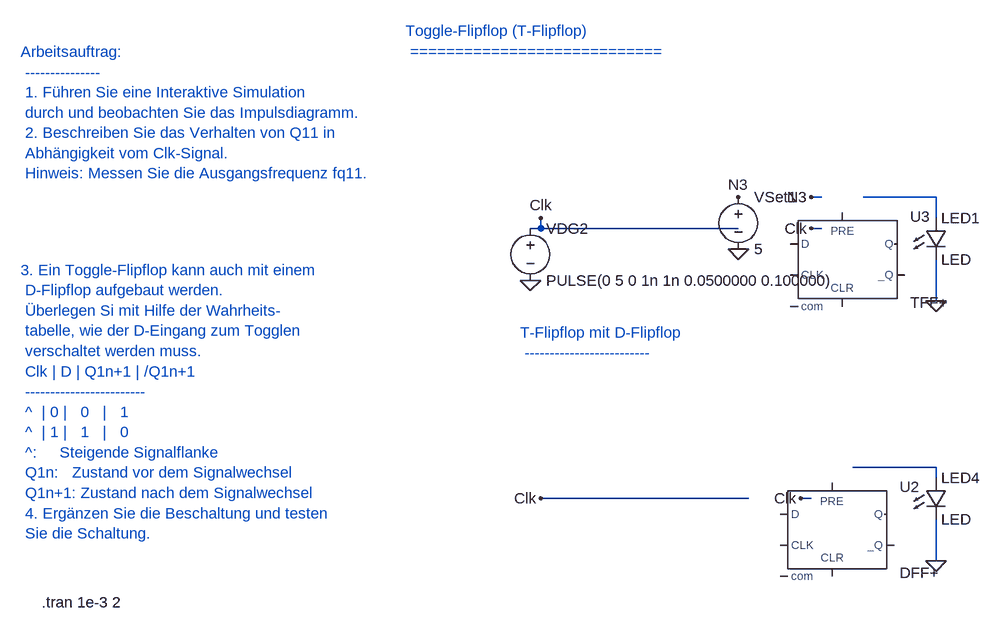
[diagram p0: schematic 6_1_5_Toggle_Flipflop.asc]
6_1_5_Toggle_Flipflop.asc, the LTspice schematic file:
Version 4
SHEET 1 880 680
WIRE 1440 400 1440 432
WIRE 1440 800 1440 832
WIRE 1440 464 1440 432
WIRE 816 352 832 352
WIRE 832 336 832 352
WIRE 832 768 1152 768
WIRE 1440 864 1440 832
WIRE 1312 720 1440 720
WIRE 1440 720 1440 736
WIRE 1328 304 1440 304
WIRE 1440 304 1440 336
WIRE 832 352 1136 352
WIRE 1248 768 1232 768
WIRE 1264 352 1248 352
WIRE 1264 304 1248 304
FLAG 1136 384 0
FLAG 816 432 0
FLAG 1440 464 0
FLAG 1440 864 0
FLAG 1440 464 0
FLAG 1440 864 0
FLAG 832 336 Clk
FLAG 832 768 Clk
FLAG 1232 768 Clk
FLAG 1248 352 Clk
FLAG 1136 304 N3
FLAG 1248 304 N3
SYMBOL voltage 1136 288 R0
SYMATTR InstName VSet1
SYMATTR Value 5
SYMBOL LED 1424 336 R0
SYMATTR InstName LED1
SYMATTR Value LED
SYMBOL voltage 816 336 R0
SYMATTR InstName VDG2
SYMATTR Value PULSE(0 5 0 1n 1n 0.0500000 0.100000)
SYMBOL Digital\dflop 1280 744 R0
SYMATTR InstName U2
SYMATTR Value DFF+
SYMATTR LibreSpice kind=dff;edge=rising;async=high;vth=2.5;vhigh=5;pins=D,CLK,SET,RESET,Q,~Q
SYMBOL LED 1424 736 R0
SYMATTR InstName LED4
SYMATTR Value LED
SYMBOL Digital\dflop 1296 328 R0
SYMATTR InstName U3
SYMATTR Value TFF+
SYMATTR LibreSpice kind=tff;edge=rising;async=high;vth=2.5;vhigh=5;pins=T,CLK,SET,RESET,Q,~Q
TEXT 64 928 Left 2 !.tran 1e-3 2
TEXT 624 48 Left 2 ;Toggle-Flipflop (T-Flipflop) \n ============================
TEXT 32 80 Left 2 ;Arbeitsauftrag: \n --------------- \n 1. Führen Sie eine Interaktive Simulation \n durch und beobachten Sie das Impulsdiagramm. \n 2. Beschreiben Sie das Verhalten von Q11 in \n Abhängigkeit vom Clk-Signal. \n Hinweis: Messen Sie die Ausgangsfrequenz fq11.
TEXT 32 416 Left 2 ;3. Ein Toggle-Flipflop kann auch mit einem \n D-Flipflop aufgebaut werden. \n Überlegen Si mit Hilfe der Wahrheits- \n tabelle, wie der D-Eingang zum Togglen \n verschaltet werden muss. \n Clk | D | Q1n+1 | /Q1n+1 \n ------------------------ \n ^  | 0 |   0   |   1 \n ^  | 1 |   1   |   0 \n ^:     Steigende Signalflanke \n Q1n:   Zustand vor dem Signalwechsel \n Q1n+1: Zustand nach dem Signalwechsel \n 4. Ergänzen Sie die Beschaltung und testen \n Sie die Schaltung.
TEXT 800 512 Left 2 ;T-Flipflop mit D-Flipflop \n -------------------------

The netlist it stands for:
* 6_1_5_Toggle_Flipflop.asc
VSet1 N3 0 5
D§LED1 N002 0 LED
VDG2 Clk 0 PULSE(0 5 0 1n 1n 0.0500000 0.100000)
A§U2 0 0 0 0 0 0 0 0 DFLOP DFF+
D§LED4 N001 0 LED
A§U3 0 0 0 0 0 0 0 0 DFLOP TFF+
.model D D
.lib standard.dio
.tran 1e-3 2
* Toggle-Flipflop (T-Flipflop)
*  ============================
* Arbeitsauftrag:
*  ---------------
*  1. Führen Sie eine Interaktive Simulation
*  durch und beobachten Sie das Impulsdiagramm.
*  2. Beschreiben Sie das Verhalten von Q11 in
*  Abhängigkeit vom Clk-Signal.
*  Hinweis: Messen Sie die Ausgangsfrequenz fq11.
* 3. Ein Toggle-Flipflop kann auch mit einem
*  D-Flipflop aufgebaut werden.
*  Überlegen Si mit Hilfe der Wahrheits-
*  tabelle, wie der D-Eingang zum Togglen
*  verschaltet werden muss.
*  Clk | D | Q1n+1 | /Q1n+1
*  ------------------------
*  ^  | 0 |   0   |   1
*  ^  | 1 |   1   |   0
*  ^:     Steigende Signalflanke
*  Q1n:   Zustand vor dem Signalwechsel
*  Q1n+1: Zustand nach dem Signalwechsel
*  4. Ergänzen Sie die Beschaltung und testen
*  Sie die Schaltung.
* T-Flipflop mit D-Flipflop
*  -------------------------
.backanno
.end